# Altium project dory-x.PrjPcb (part 11 of 12)
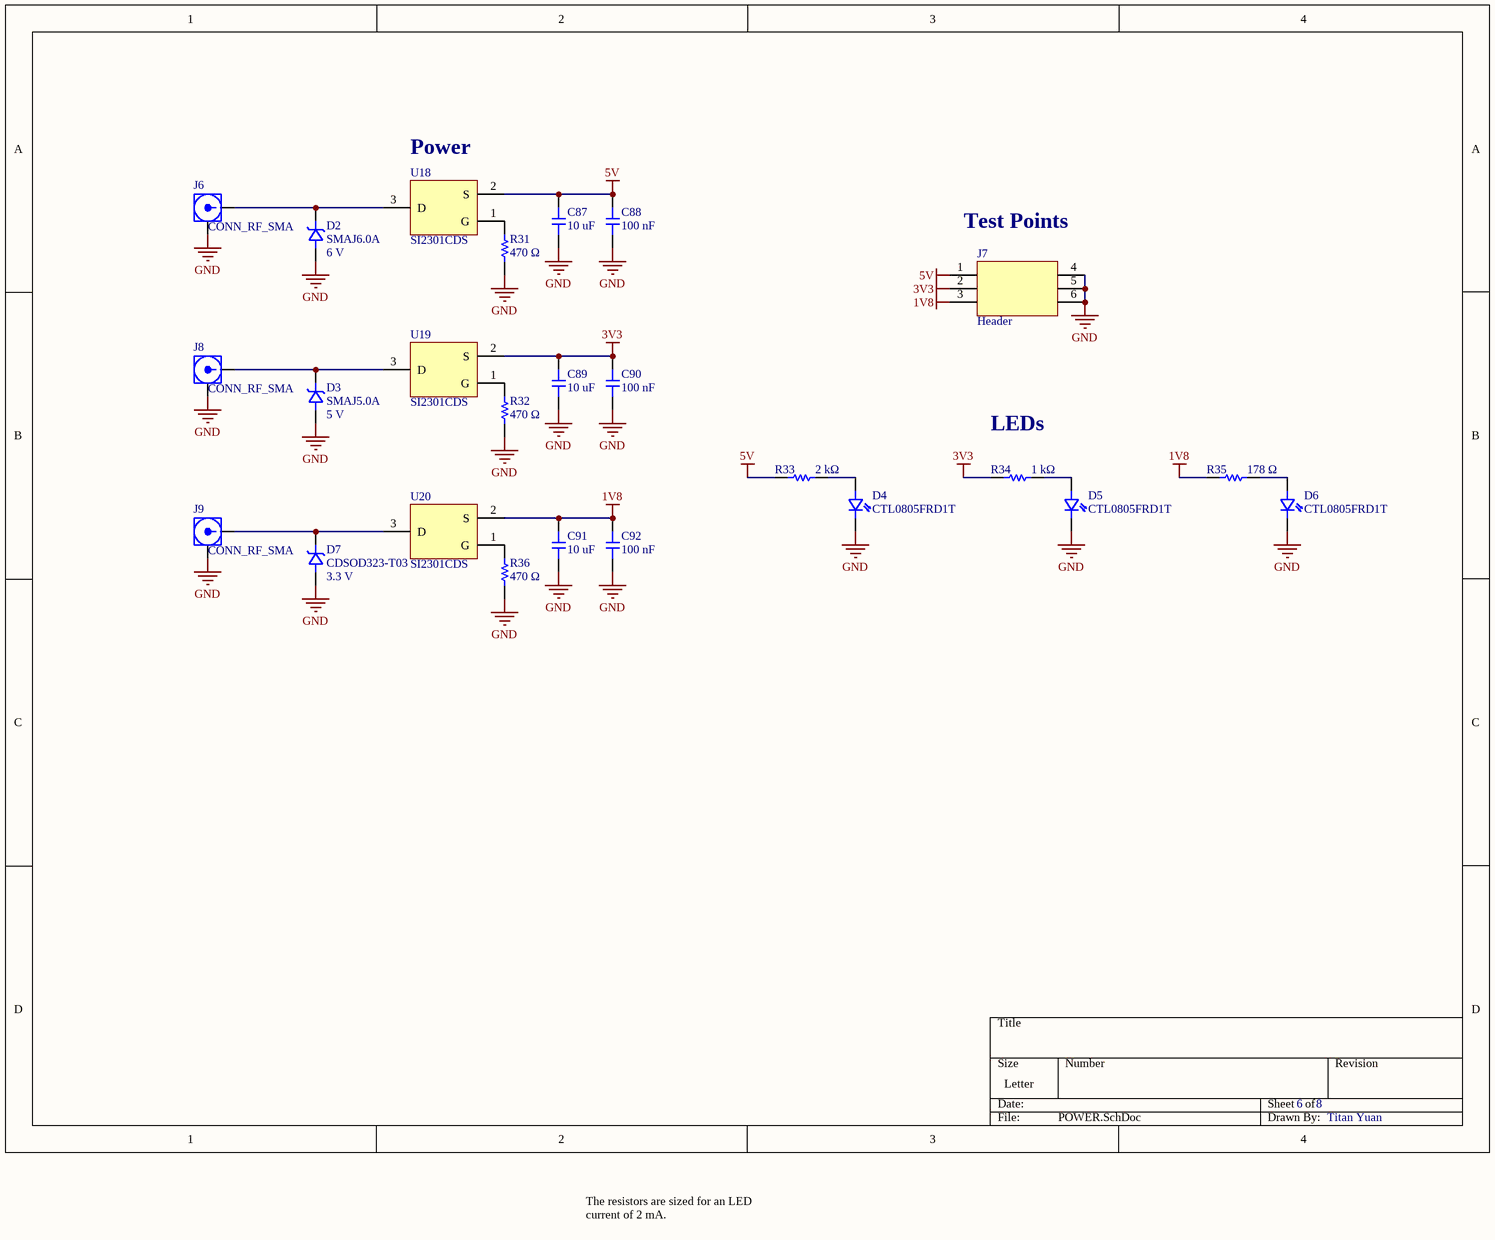
[diagram p17: POWER.SchDoc]

## Sheet POWER.SchDoc (continued)
### Library data of the parts
C87 C89 C91 = CAP: 10V 10uF X7R ±10% 0603 Multilayer Ceramic Capacitors MLCC - SMD/SMT ROHS; Manufacturer: Murata Electronics; Manufacturer Part Number: GRM188Z71A106KA73D; Manufacturer Lifecycle Status: IN PRODUCTION; Tolerance: +-10%; Value: 10µF; Voltage Rating: 10 V; Dielectric: Ceramic; Package Size: 0603; Supplier: DigiKey; Supplier Part Number: 490-GRM188Z71A106KA73DCT-ND; RoHS: Compliant; Category: Ceramic Capacitors; Stock: 395206; Pricing: 1=0.24, 10=0.141, 50=0.1016, 100=0.0903, 500=0.0767, 1000=0.07013 (USD); Case/Package: 0603; Dielectric Material: Ceramic; Export Control Classification Number (ECCN) Code: EAR99; Height: 800µm; Harmonized Tariff Schedule (HTS) Code: 8532.24.00.20; Introduction Date: 2017-02-21; Length: 1.6mm; Lifecycle Status: Production; Material: Ceramic; Max Operating Temperature: 125°C; Min Operating Temperature: -55°C; Mounting Technology: Surface Mount; Number of Terminals: 2; REACH SVHC: Yes; Schedule B: 8532240020, 8532240020|8532240020|8532240020|8532240020|8532240020; Thickness: 800µm; Voltage Rating (DC): 10V; Width: 800µm; ComponentLink1URL: https://datasheet.octopart.com:443/GRM188Z71A106KA73D-Murata-datasheet-141276001.pdf?src-supplier=Geoflip; ComponentLink1Description: https://datasheet.octopart.com:443/GRM188Z71A106KA73D-Murata-datasheet-141276001.pdf?src-supplier=Geoflip; ComponentLink2URL: https://datasheet.octopart.com:443/GRM188Z71A106KA73D-Murata-datasheet-165579666.pdf?src-supplier=TME; ComponentLink2Description: https://datasheet.octopart.com:443/GRM188Z71A106KA73D-Murata-datasheet-165579666.pdf?src-supplier=TME; ComponentLink3URL: https://datasheet.octopart.com:443/GRM188Z71A106KA73D-Murata-datasheet-140705911.pdf?src-supplier=Ciiva; ComponentLink3Description: https://datasheet.octopart.com:443/GRM188Z71A106KA73D-Murata-datasheet-140705911.pdf?src-supplier=Ciiva; ComponentLink4URL: https://datasheet.octopart.com:443/GRM188Z71A106KA73D-Murata-datasheet-138743429.pdf?src-supplier=Ciiva; ComponentLink4Description: https://datasheet.octopart.com:443/GRM188Z71A106KA73D-Murata-datasheet-138743429.pdf?src-supplier=Ciiva; ComponentLink5URL: http://sigma.octopart.com:80/reach_statement/Murata-company-16.pdf?src-supplier=Compliance+Statements; ComponentLink5Description: http://sigma.octopart.com:80/reach_statement/Murata-company-16.pdf?src-supplier=Compliance+Statements
C88 C90 C92 = CAP: Ceramic Capacitor, Ceramic, 50V, 10% +Tol, 10% -Tol, X7R, 15% TC, 0.1uF, Surface Mount, 0402; Manufacturer: Yageo; Manufacturer Part Number: CC0402KPX7R9BB104; Tolerance: +-10%; Value: 100nF; Voltage Rating: 50 V; Dielectric: Ceramic; Package Size: 0402; Supplier: DigiKey; Supplier Part Number: 13-CC0402KPX7R9BB104CT-ND; RoHS: Compliant; Category: Ceramic Capacitors; Stock: 40680; Pricing: 1=0.1, 10=0.053, 50=0.0364, 100=0.0313, 500=0.02292, 1000=0.02035, 2500=0.01764, 5000=0.01601 (USD); Case/Package: 0402; China RoHS: Compliant; Dielectric Material: Ceramic; Height: 500µm; Lead Free: Lead Free; Length: 1mm; Lifecycle Status: Production; Max Operating Temperature: 125°C; Min Operating Temperature: -55°C; Mounting Technology: Surface Mount; Number of Terminals: 2; REACH SVHC: Yes; Voltage Rating (DC): 50V; Width: 500µm; ComponentLink1URL: https://datasheet.octopart.com:443/CC0402KPX7R9BB104-Yageo-datasheet-177165144.pdf?src-supplier=IHS; ComponentLink1Description: https://datasheet.octopart.com:443/CC0402KPX7R9BB104-Yageo-datasheet-177165144.pdf?src-supplier=IHS; ComponentLink2URL: https://datasheet.octopart.com:443/CC0402KPX7R9BB104-Yageo-Group-datasheet-189192896.pdf?src-supplier=Future+Electronics; ComponentLink2Description: https://datasheet.octopart.com:443/CC0402KPX7R9BB104-Yageo-Group-datasheet-189192896.pdf?src-supplier=Future+Electronics; ComponentLink3URL: https://datasheet.octopart.com:443/CC0402KPX7R9BB104-Yageo-datasheet-181967134.pdf?src-supplier=Farnell; ComponentLink3Description: https://datasheet.octopart.com:443/CC0402KPX7R9BB104-Yageo-datasheet-181967134.pdf?src-supplier=Farnell; ComponentLink4URL: https://datasheet.octopart.com/Surface-Mount-Ceramic-Multilayer-Capacitors%3B-General-Purpose-%26-High-Capacitance-Class-2%2C-X7R-Yageo-datasheet-family-114.pdf; ComponentLink4Description: https://datasheet.octopart.com/Surface-Mount-Ceramic-Multilayer-Capacitors%3B-General-Purpose-%26-High-Capacitance-Class-2%2C-X7R-Yageo-datasheet-family-114.pdf; ComponentLink5URL: https://datasheet.octopart.com/CC0402KPX7R9BB104-Yageo-datasheet-10883670.pdf; ComponentLink5Description: https://datasheet.octopart.com/CC0402KPX7R9BB104-Yageo-datasheet-10883670.pdf; ComponentLink6URL: http://sigma.octopart.com:80/rohs_statement/Surface-Mount-Ceramic-Multilayer-Capacitors%3B-General-Purpose-%26-High-Capacitance-Class-2%2C-X7R-Yageo-family-124.pdf?src-supplier=Compliance+Statements; ComponentLink6Description: http://sigma.octopart.com:80/rohs_statement/Surface-Mount-Ceramic-Multilayer-Capacitors%3B-General-Purpose-%26-High-Capacitance-Class-2%2C-X7R-Yageo-family-124.pdf?src-supplier=Compliance+Statements; ComponentLink7URL: http://sigma.octopart.com:80/reach_statement/Surface-Mount-Ceramic-Multilayer-Capacitors%3B-General-Purpose-%26-High-Capacitance-Class-2%2C-X7R-Yageo-family-125.pdf?src-supplier=Compliance+Statements; ComponentLink7Description: http://sigma.octopart.com:80/reach_statement/Surface-Mount-Ceramic-Multilayer-Capacitors%3B-General-Purpose-%26-High-Capacitance-Class-2%2C-X7R-Yageo-family-125.pdf?src-supplier=Compliance+Statements; ComponentLink8URL: http://sigma.octopart.com:80/conflict_mineral_statement/Yageo-company-3.pdf?src-supplier=Compliance+Statements; ComponentLink8Description: http://sigma.octopart.com:80/conflict_mineral_statement/Yageo-company-3.pdf?src-supplier=Compliance+Statements; ComponentLink9URL: http://sigma.octopart.com:80/rohs_statement/Yageo-company-2.pdf?src-supplier=Compliance+Statements; ComponentLink9Description: http://sigma.octopart.com:80/rohs_statement/Yageo-company-2.pdf?src-supplier=Compliance+Statements
D2 = SMAJ6.0A: SMAJ Series 10.3 V 0.4 kW Surface Mount Uni-Directional TVS Diode - DO-214AC; Manufacturer: Littelfuse Inc.; Breakdown Voltage: 6.67 V; Maximum Clamping Voltage: 10.3 V; Clamping Voltage: 10.3V; Current: 41A; Direction: Unidirectional; Forward Voltage: 3.5V; Leakage Current: 1µA; Max Breakdown Voltage: 7.37V; Max Junction Temperature (Tj): 150°C; Max Power Dissipation: 3.3W; Max Reverse Leakage Current: 800µA; Max Surge Current: 38.8A; Min Breakdown Voltage: 6.67V; Number of Channels: 1; Operating Supply Voltage: 6V; Peak Pulse Power: 400W; Power Line Protection: No; Reverse Breakdown Voltage: 66.7V; Test Current: 10mA; Voltage: 60V; Manufacturer Part Number: SMAJ6.0A; Supplier: DigiKey; Supplier Part Number: SMAJ6.0ALFDKR-ND; RoHS: Compliant; Category: TVS Diodes; Stock: 44995; Pricing: 1=0.16, 10=0.129, 100=0.098, 500=0.097, 1000=0.096, 2000=0.0955 (USD); China RoHS: Non-Compliant; Composition: Zener; Country of Origin: Mainland China, Malaysia; Export Control Classification Number (ECCN) Code: EAR99; Height: 2.29mm; Harmonized Tariff Schedule (HTS) Code: 8541.10.00.50; Introduction Date: 2003-11-20; Lead Free: Lead Free; Length: 5.28mm; Lifecycle Status: Production; Max Operating Temperature: 150°C; Min Operating Temperature: -65°C; Mounting Technology: Surface Mount; Number of Elements: 1; Pins: 2; Number of Terminals: 2; Number of Unidirectional Channels: 1; Packaging: Cut Tape; Peak Pulse Current: 38.8A; Peak Reverse Current: 800µA; Polarity: Unidirectional; Power Dissipation: 400W; Power Rating: 400W; Radiation Hardening: No; REACH SVHC: No; Reverse Voltage: 6V; Schedule B: 8541100080, 8541100080|8541100080|8541100080|8541100080|8541100080; Termination: SMD/SMT; Voltage Rating (DC): 6V; Width: 2.79mm; ComponentLink1URL: https://datasheet.octopart.com:443/SMAJ6.0A-Littelfuse-datasheet-150463581.pdf?src-supplier=Newark; ComponentLink1Description: https://datasheet.octopart.com:443/SMAJ6.0A-Littelfuse-datasheet-150463581.pdf?src-supplier=Newark; ComponentLink2URL: https://datasheet.octopart.com:443/SMAJ6.0A-Littelfuse-datasheet-63710798.pdf?src-supplier=element14+APAC; ComponentLink2Description: https://datasheet.octopart.com:443/SMAJ6.0A-Littelfuse-datasheet-63710798.pdf?src-supplier=element14+APAC; ComponentLink3URL: https://datasheet.octopart.com:443/SMAJ6.0A-Littelfuse-datasheet-11547152.pdf?src-supplier=Farnell; ComponentLink3Description: https://datasheet.octopart.com:443/SMAJ6.0A-Littelfuse-datasheet-11547152.pdf?src-supplier=Farnell; ComponentLink4URL: https://datasheet.octopart.com:443/SMAJ6.0A-Littelfuse-datasheet-5393952.pdf?src-supplier=Farnell; ComponentLink4Description: https://datasheet.octopart.com:443/SMAJ6.0A-Littelfuse-datasheet-5393952.pdf?src-supplier=Farnell; ComponentLink5URL: https://datasheet.octopart.com:443/SMAJ6.0A-Littelfuse-datasheet-511791.pdf?src-supplier=Farnell; ComponentLink5Description: https://datasheet.octopart.com:443/SMAJ6.0A-Littelfuse-datasheet-511791.pdf?src-supplier=Farnell; ComponentLink6URL: https://datasheet.octopart.com:443/SMAJ6.0A-Littelfuse-datasheet-165289143.pdf?src-supplier=Electro+Sonic; ComponentLink6Description: https://datasheet.octopart.com:443/SMAJ6.0A-Littelfuse-datasheet-165289143.pdf?src-supplier=Electro+Sonic; ComponentLink7URL: https://datasheet.octopart.com:443/SMAJ6.0A-Littelfuse-datasheet-112042111.pdf?src-supplier=JRH+Electronics; ComponentLink7Description: https://datasheet.octopart.com:443/SMAJ6.0A-Littelfuse-datasheet-112042111.pdf?src-supplier=JRH+Electronics; ComponentLink8URL: https://datasheet.octopart.com:443/SMAJ6.0A-Littelfuse-datasheet-17901671.pdf?src-supplier=Future+Electronics; ComponentLink8Description: https://datasheet.octopart.com:443/SMAJ6.0A-Littelfuse-datasheet-17901671.pdf?src-supplier=Future+Electronics; ComponentLink9URL: https://datasheet.octopart.com:443/SMAJ6.0A-Littelfuse-datasheet-1053.pdf?src-supplier=DigiKey; ComponentLink9Description: https://datasheet.octopart.com:443/SMAJ6.0A-Littelfuse-datasheet-1053.pdf?src-supplier=DigiKey
D3 = SMAJ5.0A: SMAJ Series 9.2 V 400 W Surface Mount Uni-Directional TVS Diode - DO-214AC; Manufacturer: Littelfuse Inc.; Breakdown Voltage: 6.40 V; Maximum Clamping Voltage: 9.2 V; Clamping Voltage: 9.2V; Direction: Unidirectional; Element Configuration: Single; Forward Voltage: 3.5V; Leakage Current: 800µA; Max Breakdown Voltage: 7V; Max Junction Temperature (Tj): 150°C; Max Power Dissipation: 3.3W; Max Surge Current: 43.5A; Min Breakdown Voltage: 6.4V; Number of Channels: 1; Operating Supply Voltage: 5V; Peak Pulse Power: 400W; Power Line Protection: No; Test Current: 10mA; Manufacturer Part Number: SMAJ5.0A; Supplier: DigiKey; Supplier Part Number: SMAJ5.0ALFDKR-ND; RoHS: Compliant; Category: TVS Diodes; Stock: 91126; Pricing: 1=0.23, 10=0.172, 100=0.101, 500=0.1, 1000=0.09, 2000=0.089 (USD); Composition: Zener; Country of Origin: Mainland China; Export Control Classification Number (ECCN) Code: EAR99; Height: 2.29mm; Harmonized Tariff Schedule (HTS) Code: 8541.10.00.50; Introduction Date: 2003-11-20; Lead Free: Lead Free; Length: 4.5mm; Lifecycle Status: Production; Max Operating Temperature: 150°C; Max Reverse Leakage Current: 800µA; Min Operating Temperature: -65°C; Mounting Technology: Surface Mount; Number of Elements: 1; Pins: 2; Number of Terminals: 2; Number of Unidirectional Channels: 1; Packaging: Tape & Reel; Peak Pulse Current: 43.5A; Peak Reverse Current: 800µA; Polarity: Unidirectional; Power Rating: 400W; Radiation Hardening: No; REACH SVHC: No; Reverse Breakdown Voltage: 6.4V; Reverse Voltage: 5V; Schedule B: 8541100080, 8541100080|8541100080, 8541100080|8541100080|8541100080, 8541100080|8541100080|8541100080|8541100080; Termination: SMD/SMT; Voltage Rating (DC): 5V; Width: 2.79mm; ComponentLink1URL: https://datasheet.octopart.com:443/SMAJ5.0A-Littelfuse-datasheet-150463581.pdf?src-supplier=Farnell; ComponentLink1Description: https://datasheet.octopart.com:443/SMAJ5.0A-Littelfuse-datasheet-150463581.pdf?src-supplier=Farnell; ComponentLink2URL: https://datasheet.octopart.com:443/SMAJ5.0A-Littelfuse-datasheet-63710798.pdf?src-supplier=Farnell; ComponentLink2Description: https://datasheet.octopart.com:443/SMAJ5.0A-Littelfuse-datasheet-63710798.pdf?src-supplier=Farnell; ComponentLink3URL: https://datasheet.octopart.com:443/SMAJ5.0A-Littelfuse-datasheet-11547152.pdf?src-supplier=element14+APAC; ComponentLink3Description: https://datasheet.octopart.com:443/SMAJ5.0A-Littelfuse-datasheet-11547152.pdf?src-supplier=element14+APAC; ComponentLink4URL: https://datasheet.octopart.com:443/SMAJ5.0A-Littelfuse-datasheet-5393952.pdf?src-supplier=element14+APAC; ComponentLink4Description: https://datasheet.octopart.com:443/SMAJ5.0A-Littelfuse-datasheet-5393952.pdf?src-supplier=element14+APAC; ComponentLink5URL: https://datasheet.octopart.com:443/SMAJ5.0A-Littelfuse-datasheet-511791.pdf?src-supplier=element14+APAC; ComponentLink5Description: https://datasheet.octopart.com:443/SMAJ5.0A-Littelfuse-datasheet-511791.pdf?src-supplier=element14+APAC; ComponentLink6URL: https://datasheet.octopart.com:443/SMAJ5.0A-Littelfuse-datasheet-38878911.pdf?src-supplier=Burklin+Elektronik; ComponentLink6Description: https://datasheet.octopart.com:443/SMAJ5.0A-Littelfuse-datasheet-38878911.pdf?src-supplier=Burklin+Elektronik; ComponentLink7URL: https://datasheet.octopart.com:443/SMAJ5.0A-Littelfuse-datasheet-164649624.pdf?src-supplier=JRH+Electronics; ComponentLink7Description: https://datasheet.octopart.com:443/SMAJ5.0A-Littelfuse-datasheet-164649624.pdf?src-supplier=JRH+Electronics; ComponentLink8URL: https://datasheet.octopart.com:443/SMAJ5.0A-Littelfuse-datasheet-17901671.pdf?src-supplier=Future+Electronics; ComponentLink8Description: https://datasheet.octopart.com:443/SMAJ5.0A-Littelfuse-datasheet-17901671.pdf?src-supplier=Future+Electronics; ComponentLink9URL: https://datasheet.octopart.com:443/SMAJ5.0A-Littelfuse-datasheet-1053.pdf?src-supplier=DigiKey; ComponentLink9Description: https://datasheet.octopart.com:443/SMAJ5.0A-Littelfuse-datasheet-1053.pdf?src-supplier=DigiKey
D4-D6 = CTL0805FRD1T: Chip Type LED, 0805, Flat Lens, Red; Manufacturer: Venkel; Manufacturer Part Number: CTL0805FRD1T-CT; Forward Voltage: 1.5 V; Current: 20 mA; Package Size: 0805
D7 = CDSOD323-T03: ESD protection diodes / TVS diodes; BOURNS; CDSOD323-T03; 19 V; 20 A; 3.3 V; 4 V; Manufacturer: Bourns Inc.; Breakdown Voltage: 4 V; Maximum Clamping Voltage: 19 V; Value: 3pF; Clamping Voltage: 10.9V; Direction: Unidirectional; Element Configuration: Single; Leakage Current: 5µA; Max Junction Temperature (Tj): 150°C; Max Power Dissipation: 350W; Max Surge Current: 20A; Min Breakdown Voltage: 4V; Number of Channels: 1; Peak Reverse Current: 125µA; Power Line Protection: No; Test Current: 1mA; Working Voltage: 3.3V; Manufacturer Part Number: CDSOD323-T03; Supplier: DigiKey; Supplier Part Number: CDSOD323-T03CT-ND; RoHS: Compliant; Category: TVS Diodes; Stock: 58965; Pricing: 1=0.56, 10=0.405, 100=0.312, 500=0.294, 1000=0.28309 (USD); Composition: Zener; Contact Plating: Tin; Country of Origin: Philippines, Uk; Depth: 1.45mm; Export Control Classification Number (ECCN) Code: EAR99; Height: 1.14mm; Harmonized Tariff Schedule (HTS) Code: 8541.10.00.50; Introduction Date: 2005-10-06; Length: 1.9mm; Lifecycle Status: Production; Max Operating Temperature: 150°C; Min Operating Temperature: -55°C; Mounting Technology: Surface Mount; Number of Elements: 1; Pins: 2; Number of Terminals: 2; Number of Unidirectional Channels: 1; Peak Pulse Current: 20A; Peak Pulse Power: 350W; Polarity: Unidirectional; Radiation Hardening: No; REACH SVHC: Yes; Reverse Breakdown Voltage: 4V; Termination: SMD/SMT; Width: 1.45mm; ComponentLink1URL: https://datasheet.octopart.com:443/CDSOD323-T03-Bourns-datasheet-179966062.pdf?src-supplier=IHS; ComponentLink1Description: https://datasheet.octopart.com:443/CDSOD323-T03-Bourns-datasheet-179966062.pdf?src-supplier=IHS; ComponentLink2URL: https://datasheet.octopart.com:443/CDSOD323-T03-Bourns-datasheet-28808730.pdf?src-supplier=Newark; ComponentLink2Description: https://datasheet.octopart.com:443/CDSOD323-T03-Bourns-datasheet-28808730.pdf?src-supplier=Newark; ComponentLink3URL: https://datasheet.octopart.com:443/CDSOD323-T03-Bourns-datasheet-22084022.pdf?src-supplier=Burklin+Elektronik; ComponentLink3Description: https://datasheet.octopart.com:443/CDSOD323-T03-Bourns-datasheet-22084022.pdf?src-supplier=Burklin+Elektronik; ComponentLink4URL: https://datasheet.octopart.com:443/CDSOD323-T03-Bourns-datasheet-13385636.pdf?src-supplier=Electro+Sonic; ComponentLink4Description: https://datasheet.octopart.com:443/CDSOD323-T03-Bourns-datasheet-13385636.pdf?src-supplier=Electro+Sonic; ComponentLink5URL: https://datasheet.octopart.com:443/CDSOD323-T03-Bourns-datasheet-154729637.pdf?src-supplier=RS+(Formerly+Allied+Electronics); ComponentLink5Description: https://datasheet.octopart.com:443/CDSOD323-T03-Bourns-datasheet-154729637.pdf?src-supplier=RS+(Formerly+Allied+Electronics); ComponentLink6URL: https://datasheet.octopart.com:443/CDSOD323-T03-Bourns-datasheet-134530210.pdf?src-supplier=HQonline; ComponentLink6Description: https://datasheet.octopart.com:443/CDSOD323-T03-Bourns-datasheet-134530210.pdf?src-supplier=HQonline; ComponentLink7URL: http://sigma.octopart.com:80/conflict_mineral_statement/Bourns-company-36.pdf?src-supplier=Compliance+Statements; ComponentLink7Description: http://sigma.octopart.com:80/conflict_mineral_statement/Bourns-company-36.pdf?src-supplier=Compliance+Statements
J6 J8 J9 = CONN_RF_SMA: RF / Coaxial Connector, SMA Coaxial, Straight Jack, Solder, 50 ohm, Beryllium Copper; Manufacturer: Cinch Connectivity Solutions Johnson; Maximum Frequency: 18 GHz; Body Material: Brass; Body Plating: Gold; Connector Type: Coaxial, PCB, SMA, Socket; Contact Resistance: 4mΩ; Dielectric Material: PTFE; Frequency: 18GHz; Gender: Female; Impedance: 50Ω; Insulation Resistance: 5GΩ; Number of Contacts: 1; Polarity: Normal; Voltage Rating: 335V; Manufacturer Part Number: 142-0701-801; Supplier: DigiKey; Supplier Part Number: J502-ND; RoHS: Compliant; Category: RF / Coaxial Connectors; Stock: 35108; Pricing: 1=3.73, 10=3.166, 25=2.9676, 50=2.826, 100=2.691, 250=2.52244, 500=2.40206, 1000=2.28748, 2500=2.1444 (USD); Case/Package: SMA; Contact Gender: Female; Contact Material: Gold, Nickel; Contact Plating: Gold; Depth: 25.58mm; Export Control Classification Number (ECCN) Code: EAR99; Fastening Type: Threaded; Height: 9.779mm; Housing Color: Gold; Housing Material: Brass; Harmonized Tariff Schedule (HTS) Code: 8536.69.40.10; Insulation Material: PTFE; Introduction Date: 1994-06-01; Lead Free: Lead Free; Length: 9.52mm; Lifecycle Status: Production; Clock Frequency: 18GHz; Max Operating Temperature: 165°C; Min Operating Temperature: -65°C; Mounting Technology: Edge, PCB; Pins: 1; Number of Ports: 1; Orientation: Straight; Radiation Hardening: No; REACH SVHC: No; Schedule B: 8536695050, 8536695050|8536695050|8536695050|8536695050|8536695050; Shell Material: Brass; Termination: Solder; ComponentLink1URL: https://datasheet.octopart.com:443/142-0701-801-Cinch-Connectors-datasheet-38159423.pdf?src-supplier=element14+APAC; ComponentLink1Description: https://datasheet.octopart.com:443/142-0701-801-Cinch-Connectors-datasheet-38159423.pdf?src-supplier=element14+APAC; ComponentLink2URL: https://datasheet.octopart.com:443/142-0701-801-Cinch-Connectivity-Solutions-datasheet-128878268.pdf?src-supplier=JRH+Electronics; ComponentLink2Description: https://datasheet.octopart.com:443/142-0701-801-Cinch-Connectivity-Solutions-datasheet-128878268.pdf?src-supplier=JRH+Electronics; ComponentLink3URL: https://datasheet.octopart.com:443/142-0701-801-Cinch-Connectivity-Solutions-datasheet-180501451.pdf?src-supplier=IHS; ComponentLink3Description: https://datasheet.octopart.com:443/142-0701-801-Cinch-Connectivity-Solutions-datasheet-180501451.pdf?src-supplier=IHS; ComponentLink4URL: https://datasheet.octopart.com:443/142-0701-801-Cinch-Connectivity-Solutions-datasheet-182240672.pdf?src-supplier=IHS; ComponentLink4Description: https://datasheet.octopart.com:443/142-0701-801-Cinch-Connectivity-Solutions-datasheet-182240672.pdf?src-supplier=IHS; ComponentLink5URL: https://datasheet.octopart.com:443/142-0701-801-Emerson-datasheet-182246267.pdf?src-supplier=IHS; ComponentLink5Description: https://datasheet.octopart.com:443/142-0701-801-Emerson-datasheet-182246267.pdf?src-supplier=IHS; ComponentLink6URL: https://datasheet.octopart.com:443/142-0701-801-Emerson-Network-Power-datasheet-40124.pdf?src-supplier=Newark; ComponentLink6Description: https://datasheet.octopart.com:443/142-0701-801-Emerson-Network-Power-datasheet-40124.pdf?src-supplier=Newark; ComponentLink7URL: https://datasheet.octopart.com:443/142-0701-801-Cinch-Connectors-datasheet-24914353.pdf?src-supplier=Electro+Sonic; ComponentLink7Description: https://datasheet.octopart.com:443/142-0701-801-Cinch-Connectors-datasheet-24914353.pdf?src-supplier=Electro+Sonic; ComponentLink8URL: https://datasheet.octopart.com:443/142-0701-801-Emerson-Network-Power-datasheet-14433785.pdf?src-supplier=Farnell; ComponentLink8Description: https://datasheet.octopart.com:443/142-0701-801-Emerson-Network-Power-datasheet-14433785.pdf?src-supplier=Farnell; ComponentLink9URL: https://datasheet.octopart.com:443/142-0701-801-Emerson-Network-Power-datasheet-8828422.pdf?src-supplier=Farnell; ComponentLink9Description: https://datasheet.octopart.com:443/142-0701-801-Emerson-Network-Power-datasheet-8828422.pdf?src-supplier=Farnell; ComponentLink10URL: https://datasheet.octopart.com:443/142-0701-801-Emerson-Network-Power-datasheet-10031126.pdf?src-supplier=Farnell; ComponentLink10Description: https://datasheet.octopart.com:443/142-0701-801-Emerson-Network-Power-datasheet-10031126.pdf?src-supplier=Farnell; ComponentLink11URL: https://datasheet.octopart.com:443/142-0701-801-Emerson-Network-Power-datasheet-47159.pdf?src-supplier=Farnell; ComponentLink11Description: https://datasheet.octopart.com:443/142-0701-801-Emerson-Network-Power-datasheet-47159.pdf?src-supplier=Farnell; ComponentLink12URL: https://datasheet.octopart.com:443/142-0701-801-Emerson-Network-Power-datasheet-29036.pdf?src-supplier=Farnell; ComponentLink12Description: https://datasheet.octopart.com:443/142-0701-801-Emerson-Network-Power-datasheet-29036.pdf?src-supplier=Farnell; ComponentLink13URL: https://datasheet.octopart.com:443/142-0701-801-Semflex-datasheet-33021794.pdf?src-supplier=East+Coast+Microwave; ComponentLink13Description: https://datasheet.octopart.com:443/142-0701-801-Semflex-datasheet-33021794.pdf?src-supplier=East+Coast+Microwave; ComponentLink14URL: https://datasheet.octopart.com:443/142-0701-801-Emerson-datasheet-31818286.pdf?src-supplier=East+Coast+Microwave; ComponentLink14Description: https://datasheet.octopart.com:443/142-0701-801-Emerson-datasheet-31818286.pdf?src-supplier=East+Coast+Microwave; ComponentLink15URL: https://datasheet.octopart.com:443/142-0701-801-Cinch-Connectors-datasheet-27682.pdf?src-supplier=RS+(Formerly+Allied+Electronics); ComponentLink15Description: https://datasheet.octopart.com:443/142-0701-801-Cinch-Connectors-datasheet-27682.pdf?src-supplier=RS+(Formerly+Allied+Electronics); ComponentLink16URL: https://datasheet.octopart.com:443/142-0701-801-Emerson-Network-Power-datasheet-644257.pdf?src-supplier=Future+Electronics; ComponentLink16Description: https://datasheet.octopart.com:443/142-0701-801-Emerson-Network-Power-datasheet-644257.pdf?src-supplier=Future+Electronics; ComponentLink17URL: https://datasheet.octopart.com:443/142-0701-801-Emerson-Network-Power-datasheet-55164.pdf?src-supplier=_legacy+Avnet; ComponentLink17Description: https://datasheet.octopart.com:443/142-0701-801-Emerson-Network-Power-datasheet-55164.pdf?src-supplier=_legacy+Avnet
J7 = CONN_2x3_2.54mm_PinHeader_Vertical: Pin Header, Board-to-Board, 2.54 mm, 2 Rows, 6 Contacts, Through Hole, TSW Series; Manufacturer: Samtec; Manufacturer Part Number: TSW-103-07-F-D; Manufacturer Lifecycle Status: PRODUCTION; Connector Type: Male Pin; Gender: Male; Max Current Rating: 7.6A; Max Voltage Rating (AC): 550V; Number of Contacts: 6; Pitch: 2.54mm; Supplier: DigiKey; Supplier Part Number: SAM10846-ND; RoHS: Compliant; Category: Headers and Wire Housings; Stock: 9841; Pricing: 1=0.32, 250=0.277, 500=0.231, 1000=0.197, 2500=0.164, 5000=0.143, 10000=0.126, 25000=0.1116 (USD); Color: Black; Contact Material: Bronze; Contact Mating Length: 5.842mm; Contact Plating: Gold; Depth: 5.08mm; Housing Color: Black; Housing Material: Polyester; Lead Pitch: 2.54mm; Lifecycle Status: Production; Max Operating Temperature: 125°C; Min Operating Temperature: -55°C; Mounting Technology: Through Hole; Pins: 6; Number of Positions: 6; Number of Rows: 2; Orientation: Straight; Radiation Hardening: No; REACH SVHC: No; Row Spacing: 2.54mm; Termination: Solder; ComponentLink1URL: https://datasheet.octopart.com:443/TSW-103-07-F-D-Samtec-datasheet-97325576.pdf?src-supplier=Sager+Electronics; ComponentLink1Description: https://datasheet.octopart.com:443/TSW-103-07-F-D-Samtec-datasheet-97325576.pdf?src-supplier=Sager+Electronics; ComponentLink2URL: https://datasheet.octopart.com:443/TSW-103-07-F-D-Samtec-datasheet-151455181.pdf?src-supplier=Sager+Electronics; ComponentLink2Description: https://datasheet.octopart.com:443/TSW-103-07-F-D-Samtec-datasheet-151455181.pdf?src-supplier=Sager+Electronics; ComponentLink3URL: https://sigma.octopart.com:443/97325577/technical_drawing/Samtec-TSW-103-07-F-D.pdf?src-supplier=Samtec; ComponentLink3Description: https://sigma.octopart.com:443/97325577/technical_drawing/Samtec-TSW-103-07-F-D.pdf?src-supplier=Samtec; ComponentLink4URL: https://datasheet.octopart.com:443/TSW-103-07-F-D-Samtec-datasheet-62107121.pdf?src-supplier=Newark; ComponentLink4Description: https://datasheet.octopart.com:443/TSW-103-07-F-D-Samtec-datasheet-62107121.pdf?src-supplier=Newark; ComponentLink5URL: https://datasheet.octopart.com:443/TSW-103-07-F-D-Samtec-datasheet-11047283.pdf?src-supplier=Newark; ComponentLink5Description: https://datasheet.octopart.com:443/TSW-103-07-F-D-Samtec-datasheet-11047283.pdf?src-supplier=Newark; ComponentLink6URL: https://datasheet.octopart.com:443/TSW-103-07-F-D-Samtec-datasheet-136646178.pdf?src-supplier=Master+Electronics; ComponentLink6Description: https://datasheet.octopart.com:443/TSW-103-07-F-D-Samtec-datasheet-136646178.pdf?src-supplier=Master+Electronics; ComponentLink7URL: https://datasheet.octopart.com:443/TSW-103-07-F-D-Samtec-datasheet-116615235.pdf?src-supplier=Electro+Sonic; ComponentLink7Description: https://datasheet.octopart.com:443/TSW-103-07-F-D-Samtec-datasheet-116615235.pdf?src-supplier=Electro+Sonic; ComponentLink8URL: https://datasheet.octopart.com:443/TSW-103-07-F-D-Samtec-datasheet-182948906.pdf?src-supplier=JRH+Electronics; ComponentLink8Description: https://datasheet.octopart.com:443/TSW-103-07-F-D-Samtec-datasheet-182948906.pdf?src-supplier=JRH+Electronics; ComponentLink9URL: https://datasheet.octopart.com:443/TSW-103-07-F-D-Samtec-datasheet-160657603.pdf?src-supplier=Toby+Electronics; ComponentLink9Description: https://datasheet.octopart.com:443/TSW-103-07-F-D-Samtec-datasheet-160657603.pdf?src-supplier=Toby+Electronics; ComponentLink10URL: https://datasheet.octopart.com:443/TSW-103-07-F-D-Samtec-datasheet-116539033.pdf?src-supplier=Toby+Electronics; ComponentLink10Description: https://datasheet.octopart.com:443/TSW-103-07-F-D-Samtec-datasheet-116539033.pdf?src-supplier=Toby+Electronics; ComponentLink11URL: https://datasheet.octopart.com:443/TSW-103-07-F-D-Samtec-datasheet-116536310.pdf?src-supplier=Toby+Electronics; ComponentLink11Description: https://datasheet.octopart.com:443/TSW-103-07-F-D-Samtec-datasheet-116536310.pdf?src-supplier=Toby+Electronics; ComponentLink12URL: https://datasheet.octopart.com/TSW-103-07-F-D-Samtec-datasheet-86818365.pdf; ComponentLink12Description: https://datasheet.octopart.com/TSW-103-07-F-D-Samtec-datasheet-86818365.pdf
R31 R32 R36 = RES: Res Thick Film 0402 470 Ohm 1% 0.063W(1/16W) ±100ppm/C Pad SMD T/R; Manufacturer: Yageo; Manufacturer Part Number: RC0402FR-07470RL; Tolerance: +-1%; Max Power Dissipation: 63mW; Power Dissipation: 62.5mW; Value: 470Ω; Temperature Coefficient: 100ppm/°C; Voltage Rating: 50V; Power Rating: 1/16 W; Package Size: 0402; Supplier: DigiKey; Supplier Part Number: 311-470LRCT-ND; RoHS: Compliant; Category: Chip SMD Resistors; Stock: 1459195; Pricing: 1=0.1, 10=0.007, 250=0.00688, 500=0.00566, 1000=0.00474, 5000=0.00328 (USD); Case/Package: 0402; Case Code (Imperial): 0402; China RoHS: Non-Compliant; Composition: Thick Film; Country of Origin: Mainland China, Taiwan; Depth: 500µm; Export Control Classification Number (ECCN) Code: EAR99; Features: Moisture Resistant; Height: 350µm; Harmonized Tariff Schedule (HTS) Code: 8533.21.00.30; Introduction Date: 2008-07-18; Lead Free: Lead Free; Length: 1mm; Lifecycle Status: Production; Max Operating Temperature: 155°C; Military Standard: Not; Min Operating Temperature: -55°C; Mounting Technology: Surface Mount; Pins: 2; Number of Terminals: 2; Number of Terminations: 2; Packaging: Cut Tape; REACH SVHC: Yes; Schedule B: 8533210045, 8533210045|8533210045, 8533210045|8533210045|8533210045, 8533210045|8533210045|8533210045|8533210045; Termination: SMD/SMT; Voltage Rating (AC): 50V; Voltage Rating (DC): 50V; Width: 500µm; Working Voltage: 50V; ComponentLink1URL: https://datasheet.octopart.com:443/RC0402FR-07470RL-Yageo-datasheet-175887523.pdf?src-supplier=IHS; ComponentLink1Description: https://datasheet.octopart.com:443/RC0402FR-07470RL-Yageo-datasheet-175887523.pdf?src-supplier=IHS; ComponentLink2URL: https://datasheet.octopart.com:443/RC0402FR-07470RL-Yageo-datasheet-62067350.pdf?src-supplier=element14+APAC; ComponentLink2Description: https://datasheet.octopart.com:443/RC0402FR-07470RL-Yageo-datasheet-62067350.pdf?src-supplier=element14+APAC; ComponentLink3URL: https://datasheet.octopart.com:443/RC0402FR-07470RL-Yageo-datasheet-10408619.pdf?src-supplier=element14+APAC; ComponentLink3Description: https://datasheet.octopart.com:443/RC0402FR-07470RL-Yageo-datasheet-10408619.pdf?src-supplier=element14+APAC; ComponentLink4URL: https://datasheet.octopart.com:443/RC0402FR-07470RL-Yageo-datasheet-103092701.pdf?src-supplier=Upverter; ComponentLink4Description: https://datasheet.octopart.com:443/RC0402FR-07470RL-Yageo-datasheet-103092701.pdf?src-supplier=Upverter; ComponentLink5URL: https://datasheet.octopart.com:443/RC0402FR-07470RL-Yageo-datasheet-68298067.pdf?src-supplier=Upverter; ComponentLink5Description: https://datasheet.octopart.com:443/RC0402FR-07470RL-Yageo-datasheet-68298067.pdf?src-supplier=Upverter; ComponentLink6URL: https://datasheet.octopart.com:443/RC0402FR-07470RL-Yageo-Group-datasheet-190305687.pdf?src-supplier=Future+Electronics; ComponentLink6Description: https://datasheet.octopart.com:443/RC0402FR-07470RL-Yageo-Group-datasheet-190305687.pdf?src-supplier=Future+Electronics; ComponentLink7URL: https://datasheet.octopart.com:443/RC0402FR-07470RL-Yageo-datasheet-164759695.pdf?src-supplier=Future+Electronics; ComponentLink7Description: https://datasheet.octopart.com:443/RC0402FR-07470RL-Yageo-datasheet-164759695.pdf?src-supplier=Future+Electronics; ComponentLink8URL: https://datasheet.octopart.com:443/RC0402FR-07470RL-Yageo-datasheet-137700087.pdf?src-supplier=Future+Electronics; ComponentLink8Description: https://datasheet.octopart.com:443/RC0402FR-07470RL-Yageo-datasheet-137700087.pdf?src-supplier=Future+Electronics; ComponentLink9URL: https://datasheet.octopart.com:443/RC0402FR-07470RL-Yageo-datasheet-12531192.pdf?src-supplier=Future+Electronics; ComponentLink9Description: https://datasheet.octopart.com:443/RC0402FR-07470RL-Yageo-datasheet-12531192.pdf?src-supplier=Future+Electronics; ComponentLink10URL: https://datasheet.octopart.com:443/RC0402FR-07470RL-Yageo-datasheet-505231.pdf?src-supplier=Future+Electronics; ComponentLink10Description: https://datasheet.octopart.com:443/RC0402FR-07470RL-Yageo-datasheet-505231.pdf?src-supplier=Future+Electronics; ComponentLink11URL: https://datasheet.octopart.com:443/RC0402FR-07470RL-Yageo-datasheet-8329306.pdf?src-supplier=element14; ComponentLink11Description: https://datasheet.octopart.com:443/RC0402FR-07470RL-Yageo-datasheet-8329306.pdf?src-supplier=element14; ComponentLink12URL: https://datasheet.octopart.com:443/RC0402FR-07470RL-Yageo-datasheet-8324527.pdf?src-supplier=Newark; ComponentLink12Description: https://datasheet.octopart.com:443/RC0402FR-07470RL-Yageo-datasheet-8324527.pdf?src-supplier=Newark; ComponentLink13URL: https://datasheet.octopart.com:443/RC0402FR-07470RL-Yageo-datasheet-175423674.pdf?src-supplier=SOS+electronic; ComponentLink13Description: https://datasheet.octopart.com:443/RC0402FR-07470RL-Yageo-datasheet-175423674.pdf?src-supplier=SOS+electronic; ComponentLink14URL: https://datasheet.octopart.com:443/RC0402FR-07470RL-Yageo-datasheet-148775077.pdf?src-supplier=TME; ComponentLink14Description: https://datasheet.octopart.com:443/RC0402FR-07470RL-Yageo-datasheet-148775077.pdf?src-supplier=TME; ComponentLink15URL: https://datasheet.octopart.com/RC0402FR-07470RL-Yageo-datasheet-73766026.pdf; ComponentLink15Description: https://datasheet.octopart.com/RC0402FR-07470RL-Yageo-datasheet-73766026.pdf; ComponentLink16URL: http://sigma.octopart.com:80/conflict_mineral_statement/Yageo-company-3.pdf?src-supplier=Compliance+Statements; ComponentLink16Description: http://sigma.octopart.com:80/conflict_mineral_statement/Yageo-company-3.pdf?src-supplier=Compliance+Statements; ComponentLink17URL: http://sigma.octopart.com:80/rohs_statement/Yageo-company-2.pdf?src-supplier=Compliance+Statements; ComponentLink17Description: http://sigma.octopart.com:80/rohs_statement/Yageo-company-2.pdf?src-supplier=Compliance+Statements
R33 = RES: 100Mw Thick Film Resistors 100Ppm/ 1% 2K 0603 Chip Resistor Surface Mount Rohs; Manufacturer: Yageo; Manufacturer Part Number: RC0603FR-072KL; Value: 2kΩ; Temperature Coefficient: 100ppm/°C; Voltage Rating: 75V; Voltage Rating (DC): 50V; Tolerance: 1%; Power Rating: *; Package Size: 0603; Supplier: DigiKey; Supplier Part Number: 311-2.00KHRCT-ND; RoHS: Compliant; Category: Chip SMD Resistors; Stock: 1454971; Pricing: 1=0.1, 10=0.007, 25=0.0068, 50=0.0056 (USD); Case/Package: 0603; Case Code (Imperial): 0603; China RoHS: Non-Compliant; Composition: Thick Film; Country of Origin: Mainland China, Taiwan; Depth: 800µm; Export Control Classification Number (ECCN) Code: EAR99; Features: Moisture Resistant; Height: 450µm; Harmonized Tariff Schedule (HTS) Code: 8533.21.00.30; Introduction Date: 2004-10-04; Lead Free: Lead Free; Length: 1.6mm; Lifecycle Status: Production; Max Operating Temperature: 155°C; Max Power Dissipation: 100mW; Military Standard: Not; Min Operating Temperature: -55°C; Mounting Technology: Surface Mount; Pins: 2; Number of Terminals: 2; Number of Terminations: 2; Packaging: Tape & Reel; Power Dissipation: 100mW; REACH SVHC: Yes; Schedule B: 8533210045, 8533210045|8533210045, 8533210045|8533210045|8533210045, 8533210045|8533210045|8533210045|8533210045; Termination: SMD/SMT; Width: 800µm; Working Voltage: 75V; ComponentLink1URL: https://datasheet.octopart.com:443/RC0603FR-072KL-Yageo-datasheet-175887523.pdf?src-supplier=Newark; ComponentLink1Description: https://datasheet.octopart.com:443/RC0603FR-072KL-Yageo-datasheet-175887523.pdf?src-supplier=Newark; ComponentLink2URL: https://datasheet.octopart.com:443/RC0603FR-072KL-Yageo-datasheet-103092701.pdf?src-supplier=Upverter; ComponentLink2Description: https://datasheet.octopart.com:443/RC0603FR-072KL-Yageo-datasheet-103092701.pdf?src-supplier=Upverter; ComponentLink3URL: https://datasheet.octopart.com:443/RC0603FR-072KL-Yageo-datasheet-8328172.pdf?src-supplier=element14+APAC; ComponentLink3Description: https://datasheet.octopart.com:443/RC0603FR-072KL-Yageo-datasheet-8328172.pdf?src-supplier=element14+APAC; ComponentLink4URL: https://datasheet.octopart.com:443/RC0603FR-072KL-Yageo-datasheet-34211833.pdf?src-supplier=element14+APAC; ComponentLink4Description: https://datasheet.octopart.com:443/RC0603FR-072KL-Yageo-datasheet-34211833.pdf?src-supplier=element14+APAC; ComponentLink5URL: https://datasheet.octopart.com:443/RC0603FR-072KL-Yageo-datasheet-62067350.pdf?src-supplier=Farnell; ComponentLink5Description: https://datasheet.octopart.com:443/RC0603FR-072KL-Yageo-datasheet-62067350.pdf?src-supplier=Farnell; ComponentLink6URL: https://datasheet.octopart.com:443/RC0603FR-072KL-Yageo-Group-datasheet-176638170.pdf?src-supplier=Future+Electronics; ComponentLink6Description: https://datasheet.octopart.com:443/RC0603FR-072KL-Yageo-Group-datasheet-176638170.pdf?src-supplier=Future+Electronics; ComponentLink7URL: https://datasheet.octopart.com:443/RC0603FR-072KL-Yageo-datasheet-164759695.pdf?src-supplier=Future+Electronics; ComponentLink7Description: https://datasheet.octopart.com:443/RC0603FR-072KL-Yageo-datasheet-164759695.pdf?src-supplier=Future+Electronics; ComponentLink8URL: https://datasheet.octopart.com:443/RC0603FR-072KL-Yageo-datasheet-137700087.pdf?src-supplier=Future+Electronics; ComponentLink8Description: https://datasheet.octopart.com:443/RC0603FR-072KL-Yageo-datasheet-137700087.pdf?src-supplier=Future+Electronics; ComponentLink9URL: https://datasheet.octopart.com:443/RC0603FR-072KL-Yageo-datasheet-27584510.pdf?src-supplier=Future+Electronics; ComponentLink9Description: https://datasheet.octopart.com:443/RC0603FR-072KL-Yageo-datasheet-27584510.pdf?src-supplier=Future+Electronics; ComponentLink10URL: https://datasheet.octopart.com:443/RC0603FR-072KL-Yageo-datasheet-15599030.pdf?src-supplier=Future+Electronics; ComponentLink10Description: https://datasheet.octopart.com:443/RC0603FR-072KL-Yageo-datasheet-15599030.pdf?src-supplier=Future+Electronics; ComponentLink11URL: https://datasheet.octopart.com:443/RC0603FR-072KL-Yageo-datasheet-12596169.pdf?src-supplier=Future+Electronics; ComponentLink11Description: https://datasheet.octopart.com:443/RC0603FR-072KL-Yageo-datasheet-12596169.pdf?src-supplier=Future+Electronics; ComponentLink12URL: https://datasheet.octopart.com:443/RC0603FR-072KL-Yageo-datasheet-8324193.pdf?src-supplier=Future+Electronics; ComponentLink12Description: https://datasheet.octopart.com:443/RC0603FR-072KL-Yageo-datasheet-8324193.pdf?src-supplier=Future+Electronics; ComponentLink13URL: https://datasheet.octopart.com/RC0603FR-072KL-Yageo-datasheet-73766026.pdf; ComponentLink13Description: https://datasheet.octopart.com/RC0603FR-072KL-Yageo-datasheet-73766026.pdf; ComponentLink14URL: https://datasheet.octopart.com:443/RC0603FR-072KL-Yageo-datasheet-118562.pdf?src-supplier=DigiKey; ComponentLink14Description: https://datasheet.octopart.com:443/RC0603FR-072KL-Yageo-datasheet-118562.pdf?src-supplier=DigiKey; ComponentLink15URL: https://datasheet.octopart.com:443/RC0603FR-072KL-Yageo-datasheet-14181487.pdf?src-supplier=iiiC; ComponentLink15Description: https://datasheet.octopart.com:443/RC0603FR-072KL-Yageo-datasheet-14181487.pdf?src-supplier=iiiC; ComponentLink16URL: http://sigma.octopart.com:80/conflict_mineral_statement/Yageo-company-3.pdf?src-supplier=Compliance+Statements; ComponentLink16Description: http://sigma.octopart.com:80/conflict_mineral_statement/Yageo-company-3.pdf?src-supplier=Compliance+Statements; ComponentLink17URL: http://sigma.octopart.com:80/rohs_statement/Yageo-company-2.pdf?src-supplier=Compliance+Statements; ComponentLink17Description: http://sigma.octopart.com:80/rohs_statement/Yageo-company-2.pdf?src-supplier=Compliance+Statements
R34 = RES: 100mW Thick Film Resistors 75V ±100ppm/℃ ±1% 1kΩ 0603 Chip Resistor - Surface Mount ROHS; Manufacturer: Yageo; Manufacturer Part Number: RC0603FR-071KL; Temperature Coefficient: 100ppm/°C; Voltage Rating: 50V; Tolerance: 1%; Power Rating: *; Package Size: 0603; Supplier: DigiKey; Supplier Part Number: 311-1.00KHRCT-ND; RoHS: Compliant; Category: Chip SMD Resistors; Stock: 5944272; Pricing: 1=0.1, 10=0.008, 25=0.0076, 50=0.0072, 100=0.0061, 250=0.00568, 1000=0.00569, 5000=0.00204 (USD); Case/Package: 0603; Case Code (Imperial): 0603; Case Code (Metric): 0603; China RoHS: Non-Compliant; Composition: Thick Film; Contact Plating: Tin; Country of Origin: Mainland China, Taiwan; Depth: 800µm; Export Control Classification Number (ECCN) Code: EAR99; Height: 450µm; Harmonized Tariff Schedule (HTS) Code: 8533.21.00.30; Introduction Date: 2004-10-04; Lead Free: Lead Free; Length: 1.6mm; Lifecycle Status: Production; Max Operating Temperature: 155°C; Military Standard: Not; Min Operating Temperature: -55°C; Mounting Technology: Surface Mount; Pins: 2; Number of Terminals: 2; Packaging: Tape and Reel; Power Dissipation: 100mW; Radiation Hardening: No; REACH SVHC: Yes; Value: 1kΩ; Schedule B: 8533210045, 8533210045|8533210045|8533210045|8533210045|8533210045|8533210045|8533210045|8533210045|8533210045|8533210045|8533210045|8533210045|8533210045|8533210045|8533210045|8533210045|8533210045|8533210045|8533210045|8533210045|8533210045|8533210045|8533210045|85; Termination: SMD/SMT; Voltage Rating (DC): 50V; Width: 800µm; Working Voltage: 75V; ComponentLink1URL: https://datasheet.octopart.com:443/RC0603FR-071KL-Yageo-datasheet-175887523.pdf?src-supplier=Newark; ComponentLink1Description: https://datasheet.octopart.com:443/RC0603FR-071KL-Yageo-datasheet-175887523.pdf?src-supplier=Newark; ComponentLink2URL: https://datasheet.octopart.com:443/RC0603FR-071KL-Yageo-datasheet-34211833.pdf?src-supplier=Newark; ComponentLink2Description: https://datasheet.octopart.com:443/RC0603FR-071KL-Yageo-datasheet-34211833.pdf?src-supplier=Newark; ComponentLink3URL: https://datasheet.octopart.com:443/RC0603FR-071KL-Yageo-datasheet-12596169.pdf?src-supplier=Newark; ComponentLink3Description: https://datasheet.octopart.com:443/RC0603FR-071KL-Yageo-datasheet-12596169.pdf?src-supplier=Newark; ComponentLink4URL: https://datasheet.octopart.com:443/RC0603FR-071KL-Yageo-datasheet-499455.pdf?src-supplier=Newark; ComponentLink4Description: https://datasheet.octopart.com:443/RC0603FR-071KL-Yageo-datasheet-499455.pdf?src-supplier=Newark; ComponentLink5URL: https://datasheet.octopart.com:443/RC0603FR-071KL-Yageo-datasheet-503470.pdf?src-supplier=Newark; ComponentLink5Description: https://datasheet.octopart.com:443/RC0603FR-071KL-Yageo-datasheet-503470.pdf?src-supplier=Newark; ComponentLink6URL: https://datasheet.octopart.com:443/RC0603FR-071KL-Yageo-datasheet-62067350.pdf?src-supplier=element14+APAC; ComponentLink6Description: https://datasheet.octopart.com:443/RC0603FR-071KL-Yageo-datasheet-62067350.pdf?src-supplier=element14+APAC; ComponentLink7URL: https://datasheet.octopart.com:443/RC0603FR-071KL-Yageo-datasheet-21426514.pdf?src-supplier=element14+APAC; ComponentLink7Description: https://datasheet.octopart.com:443/RC0603FR-071KL-Yageo-datasheet-21426514.pdf?src-supplier=element14+APAC; ComponentLink8URL: https://datasheet.octopart.com:443/RC0603FR-071KL-Yageo-datasheet-141265859.pdf?src-supplier=Upverter; ComponentLink8Description: https://datasheet.octopart.com:443/RC0603FR-071KL-Yageo-datasheet-141265859.pdf?src-supplier=Upverter; ComponentLink9URL: https://datasheet.octopart.com:443/RC0603FR-071KL-Yageo-datasheet-103092701.pdf?src-supplier=Upverter; ComponentLink9Description: https://datasheet.octopart.com:443/RC0603FR-071KL-Yageo-datasheet-103092701.pdf?src-supplier=Upverter; ComponentLink10URL: https://sigma.octopart.com:443/138820526/technical_drawing/Yageo-RC0603FR-071KL.pdf?src-supplier=Upverter; ComponentLink10Description: https://sigma.octopart.com:443/138820526/technical_drawing/Yageo-RC0603FR-071KL.pdf?src-supplier=Upverter; ComponentLink11URL: https://datasheet.octopart.com:443/RC0603FR-071KL-Yageo-datasheet-68297981.pdf?src-supplier=Upverter; ComponentLink11Description: https://datasheet.octopart.com:443/RC0603FR-071KL-Yageo-datasheet-68297981.pdf?src-supplier=Upverter; ComponentLink12URL: https://datasheet.octopart.com:443/RC0603FR-071KL-Yageo-datasheet-8328172.pdf?src-supplier=Farnell; ComponentLink12Description: https://datasheet.octopart.com:443/RC0603FR-071KL-Yageo-datasheet-8328172.pdf?src-supplier=Farnell; ComponentLink13URL: https://datasheet.octopart.com:443/RC0603FR-071KL-Yageo-datasheet-13691069.pdf?src-supplier=Farnell; ComponentLink13Description: https://datasheet.octopart.com:443/RC0603FR-071KL-Yageo-datasheet-13691069.pdf?src-supplier=Farnell; ComponentLink14URL: https://datasheet.octopart.com:443/RC0603FR-071KL-Yageo-datasheet-15599030.pdf?src-supplier=Seeed+Studio; ComponentLink14Description: https://datasheet.octopart.com:443/RC0603FR-071KL-Yageo-datasheet-15599030.pdf?src-supplier=Seeed+Studio; ComponentLink15URL: https://datasheet.octopart.com:443/RC0603FR-071KL-Yageo-Group-datasheet-176638170.pdf?src-supplier=Future+Electronics; ComponentLink15Description: https://datasheet.octopart.com:443/RC0603FR-071KL-Yageo-Group-datasheet-176638170.pdf?src-supplier=Future+Electronics; ComponentLink16URL: https://datasheet.octopart.com:443/RC0603FR-071KL-Yageo-datasheet-164759695.pdf?src-supplier=Future+Electronics; ComponentLink16Description: https://datasheet.octopart.com:443/RC0603FR-071KL-Yageo-datasheet-164759695.pdf?src-supplier=Future+Electronics; ComponentLink17URL: https://datasheet.octopart.com:443/RC0603FR-071KL-Yageo-datasheet-137700087.pdf?src-supplier=Future+Electronics; ComponentLink17Description: https://datasheet.octopart.com:443/RC0603FR-071KL-Yageo-datasheet-137700087.pdf?src-supplier=Future+Electronics; ComponentLink18URL: https://datasheet.octopart.com:443/RC0603FR071KL-Yageo-datasheet-27584510.pdf?src-supplier=Future+Electronics; ComponentLink18Description: https://datasheet.octopart.com:443/RC0603FR071KL-Yageo-datasheet-27584510.pdf?src-supplier=Future+Electronics; ComponentLink19URL: https://datasheet.octopart.com:443/RC0603FR-071KL-Yageo-datasheet-8324193.pdf?src-supplier=Future+Electronics; ComponentLink19Description: https://datasheet.octopart.com:443/RC0603FR-071KL-Yageo-datasheet-8324193.pdf?src-supplier=Future+Electronics; ComponentLink20URL: https://datasheet.octopart.com:443/RC0603FR-071KL-Yageo-datasheet-79472498.pdf?src-supplier=Megastar; ComponentLink20Description: https://datasheet.octopart.com:443/RC0603FR-071KL-Yageo-datasheet-79472498.pdf?src-supplier=Megastar; ComponentLink21URL: https://datasheet.octopart.com/RC0603FR-071KL-Yageo-datasheet-73766026.pdf; ComponentLink21Description: https://datasheet.octopart.com/RC0603FR-071KL-Yageo-datasheet-73766026.pdf; ComponentLink22URL: https://datasheet.octopart.com:443/RC0603FR-071KL-Yageo-datasheet-118562.pdf?src-supplier=DigiKey; ComponentLink22Description: https://datasheet.octopart.com:443/RC0603FR-071KL-Yageo-datasheet-118562.pdf?src-supplier=DigiKey; ComponentLink23URL: http://sigma.octopart.com:80/conflict_mineral_statement/Yageo-company-3.pdf?src-supplier=Compliance+Statements; ComponentLink23Description: http://sigma.octopart.com:80/conflict_mineral_statement/Yageo-company-3.pdf?src-supplier=Compliance+Statements; ComponentLink24URL: http://sigma.octopart.com:80/rohs_statement/Yageo-company-2.pdf?src-supplier=Compliance+Statements; ComponentLink24Description: http://sigma.octopart.com:80/rohs_statement/Yageo-company-2.pdf?src-supplier=Compliance+Statements